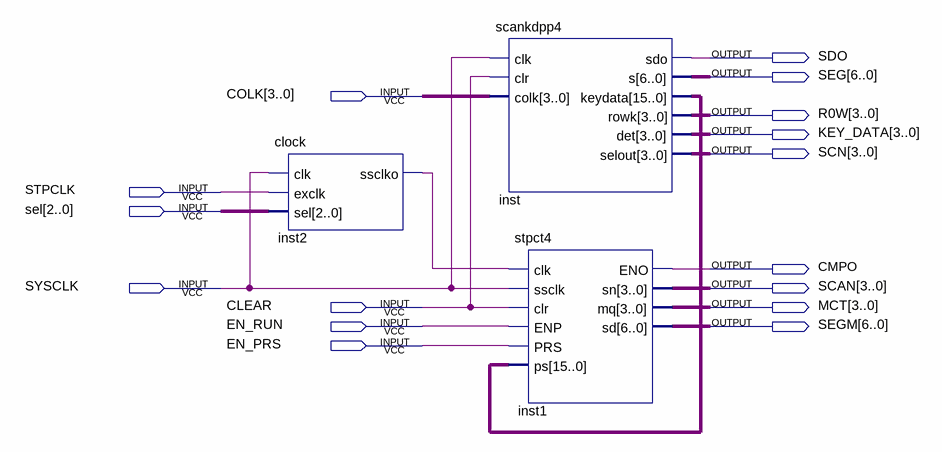
[diagram p0: schematic sheet]
// Quartus schematic STPCT4K.bdf as structural Verilog: 3 symbols, 16 pins
module STPCT4K (
  input  [3:0] COLK,
  input  STPCLK,
  input  [2:0] sel,
  input  SYSCLK,
  input  CLEAR,
  input  EN_RUN,
  input  EN_PRS,
  output SDO,
  output [6:0] SEG,
  output [3:0] R0W,
  output [3:0] KEY_DATA,
  output [3:0] SCN,
  output CMPO,
  output [3:0] SCAN,
  output [3:0] MCT,
  output [6:0] SEGM
);

  wire inst2_ssclko;
  wire [15:0] inst_keydata;

  clock inst2 (.clk(SYSCLK), .exclk(STPCLK), .sel(sel), .ssclko(inst2_ssclko));
  scankdpp4 inst (
    .clk(SYSCLK), .clr(CLEAR), .colk(COLK), .sdo(SDO), .s(SEG), .keydata(inst_keydata), .rowk(R0W),
    .det(KEY_DATA), .selout(SCN));
  stpct4 inst1 (
    .clk(inst2_ssclko), .ssclk(SYSCLK), .clr(CLEAR), .ENP(EN_RUN), .PRS(EN_PRS), .ps(inst_keydata),
    .ENO(CMPO), .sn(SCAN), .mq(MCT), .sd(SEGM));
endmodule
